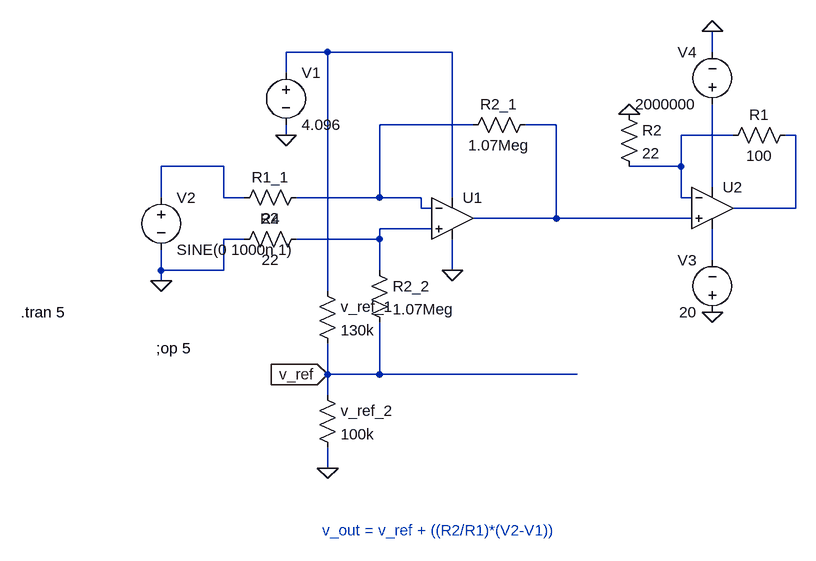
[diagram p0: schematic wheatstone_bridge_amplifier.asc]
wheatstone_bridge_amplifier.asc, the LTspice schematic file:
Version 4
SHEET 1 880 680
WIRE -128 -112 -192 -112
WIRE 64 -112 -128 -112
WIRE 464 -112 464 -144
WIRE -192 -80 -192 -112
WIRE 96 0 -48 0
WIRE 224 0 176 0
WIRE -192 16 -192 0
WIRE 496 16 416 16
WIRE 592 16 576 16
WIRE -288 64 -384 64
WIRE 416 64 416 16
WIRE 416 64 336 64
WIRE 464 96 464 -32
WIRE -384 112 -384 64
WIRE -288 112 -288 64
WIRE -256 112 -288 112
WIRE -48 112 -48 0
WIRE -48 112 -176 112
WIRE 16 112 -48 112
WIRE 64 112 64 -112
WIRE 416 112 416 64
WIRE 432 112 416 112
WIRE 16 128 16 112
WIRE 32 128 16 128
WIRE 592 128 592 16
WIRE 592 128 496 128
WIRE 224 144 224 0
WIRE 224 144 96 144
WIRE 432 144 224 144
WIRE 32 160 -48 160
WIRE -256 176 -288 176
WIRE -48 176 -48 160
WIRE -48 176 -176 176
WIRE 464 208 464 160
WIRE -384 224 -384 192
WIRE -288 224 -288 176
WIRE -288 224 -384 224
WIRE -48 224 -48 176
WIRE 64 224 64 176
WIRE -384 240 -384 224
WIRE -128 256 -128 -112
WIRE -128 384 -128 336
WIRE -48 384 -48 304
WIRE -48 384 -128 384
WIRE 256 384 -48 384
WIRE -128 416 -128 384
WIRE -128 528 -128 496
FLAG -192 16 0
FLAG -128 528 0
FLAG -384 240 0
FLAG -128 384 v_ref
IOPIN -128 384 In
FLAG 64 224 0
FLAG 464 -144 0
FLAG 464 288 0
FLAG 336 -16 0
DATAFLAG -48 384 ""
SYMBOL voltage -192 -96 R0
WINDOW 123 0 0 Left 0
WINDOW 39 0 0 Left 0
SYMATTR InstName V1
SYMATTR Value 4.096
SYMBOL res -64 208 R0
SYMATTR InstName R2_2
SYMATTR Value 1.07Meg
SYMBOL res -160 160 R90
WINDOW 0 0 56 VBottom 2
WINDOW 3 32 56 VTop 2
SYMATTR InstName R4
SYMATTR Value 22
SYMBOL res -160 96 R90
WINDOW 0 0 56 VBottom 2
WINDOW 3 32 56 VTop 2
SYMATTR InstName R1_1
SYMATTR Value 22
SYMBOL res 192 -16 R90
WINDOW 0 0 56 VBottom 2
WINDOW 3 32 56 VTop 2
SYMATTR InstName R2_1
SYMATTR Value 1.07Meg
SYMBOL voltage -384 96 R0
WINDOW 123 0 0 Left 0
WINDOW 39 0 0 Left 0
SYMATTR InstName V2
SYMATTR Value SINE(0 1000n 1)
SYMBOL OpAmps\\UniversalOpamp2 64 144 R0
SYMATTR InstName U1
SYMBOL res -144 400 R0
SYMATTR InstName v_ref_2
SYMATTR Value 100k
SYMBOL res -144 240 R0
SYMATTR InstName v_ref_1
SYMATTR Value 130k
SYMBOL OpAmps\\UniversalOpamp2 464 128 R0
SYMATTR InstName U2
SYMBOL voltage 464 -16 R180
WINDOW 0 24 96 Left 2
WINDOW 3 24 16 Left 2
WINDOW 123 0 0 Left 0
WINDOW 39 0 0 Left 0
SYMATTR InstName V4
SYMATTR Value 2000000
SYMBOL voltage 464 304 R180
WINDOW 0 24 96 Left 2
WINDOW 3 24 16 Left 2
WINDOW 123 0 0 Left 0
WINDOW 39 0 0 Left 0
SYMATTR InstName V3
SYMATTR Value 20
SYMBOL res 592 0 R90
WINDOW 0 0 56 VBottom 2
WINDOW 3 32 56 VTop 2
SYMATTR InstName R1
SYMATTR Value 100
SYMBOL res 320 -32 R0
SYMATTR InstName R2
SYMATTR Value 22
TEXT -392 344 Left 2 !;op 5
TEXT -136 624 Left 2 ;v_out = v_ref + ((R2/R1)*(V2-V1))
TEXT -600 288 Left 2 !.tran 5

The netlist it stands for:
* wheatstone_bridge_amplifier.asc
V1 N001 0 4.096
R2_2 N008 v_ref 1.07Meg
R4 N008 0 22
R1_1 N002 N006 22
R2_1 N003 N002 1.07Meg
V2 N006 0 SINE(0 1000n 1)
XU1 N008 N002 N001 0 N003 level.2 Avol=1Meg GBW=10Meg Slew=10Meg ilimit=25m rail=0 Vos=0 phimargin=45 en=0 enk=0 in=0 ink=0 Rin=500Meg  ; pins IN+ IN- V+ V- OUT
R§v_ref_2 v_ref 0 100k
R§v_ref_1 N001 v_ref 130k
XU2 N003 N004 N007 N009 N005 level.2 Avol=1Meg GBW=10Meg Slew=10Meg ilimit=25m rail=0 Vos=0 phimargin=45 en=0 enk=0 in=0 ink=0 Rin=500Meg  ; pins IN+ IN- V+ V- OUT
V4 N007 0 2000000
V3 0 N009 20
R1 N005 N004 100
R2 0 N004 22
;op 5
* v_out = v_ref + ((R2/R1)*(V2-V1))
.tran 5
.lib UniversalOpamps2.sub
.backanno
.end